# EAGLE design luci2_device_revA (EAGLE 6.3)
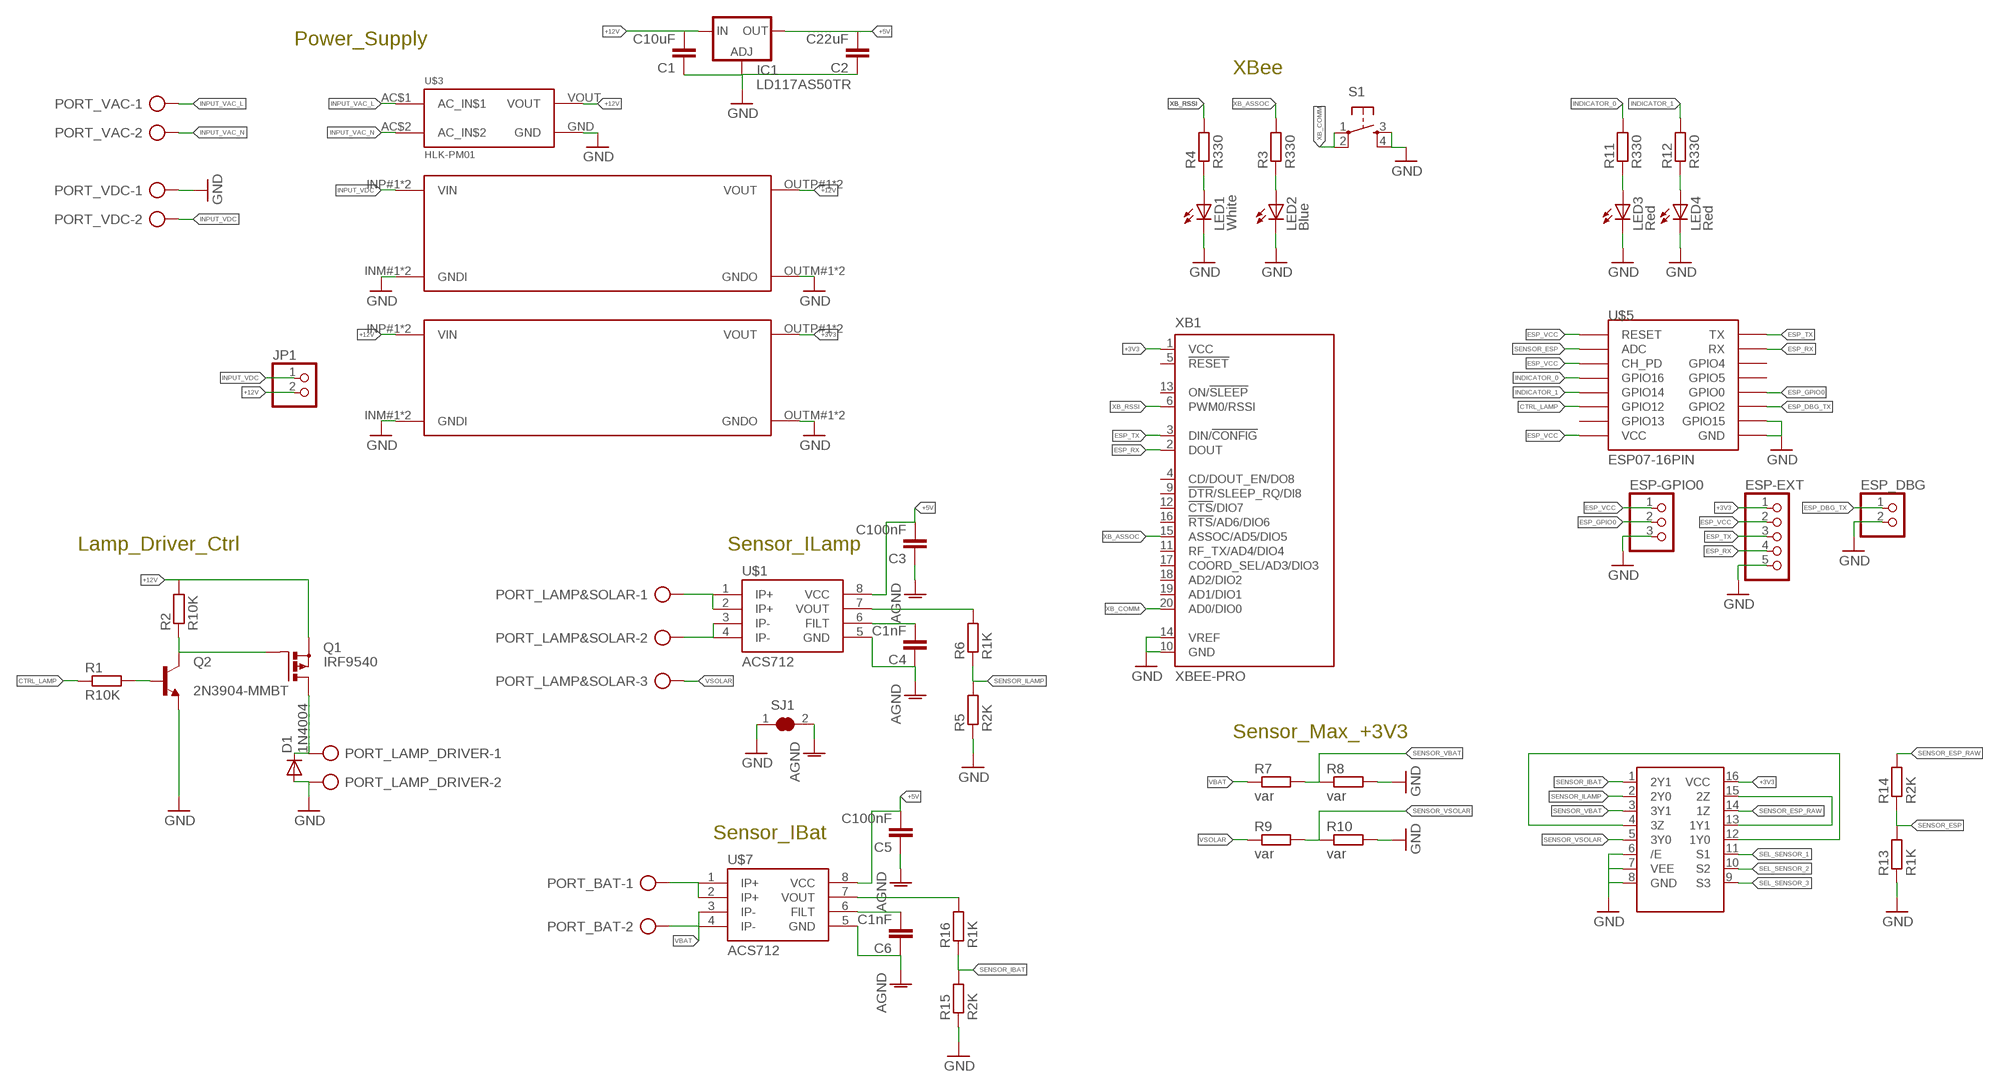
[diagram p0: schematic, sheet 1]

## Parts
C1  C10uF  C-EUC0805  [C0805]
C2  C22uF  C-EUC0805  [C0805]
C3  C100nF  C-EUC0805  [C0805]
C4  C1nF  C-EUC0805  [C0805]
C5  C100nF  C-EUC0805  [C0805]
C6  C1nF  C-EUC0805  [C0805]
D1  1N4004  [DO41-10]
ESP-EXT  HEADER-1X5ROUND  [1X05_ROUND]
ESP-GPIO0  HEADER-1X3ROUND  [1X03_ROUND]
ESP_DBG  HEADER-1X2ROUND  [1X02_ROUND]
IC1  LD117AS50TR  [SOT223]
JP1  HEADER-1X2ROUND  [1X02_ROUND]
LED1  White  LEDCHIPLED_0805  [CHIPLED_0805]
LED2  Blue  LEDCHIPLED_0805  [CHIPLED_0805]
LED3  Red  LEDCHIPLED_0805  [CHIPLED_0805]
LED4  Red  LEDCHIPLED_0805  [CHIPLED_0805]
PORT_BAT  AK300/2  [AK300/2]
PORT_LAMP&SOLAR  AK300/3  [AK300/3]
PORT_LAMP_DRIVER  AK300/2  [AK300/2]
PORT_VAC  AK300/2  [AK300/2]
PORT_VDC  AK300/2  [AK300/2]
Q1  IRF9540  PMOSFET_PTO220BV  [TO220BV]
Q2  2N3904-MMBT  [SOT23]
R1  R10K  R-EU_M0805  [M0805]
R2  R10K  R-EU_M0805  [M0805]
R3  R330  R-EU_M0805  [M0805]
R4  R330  R-EU_M0805  [M0805]
R5  R2K  R-EU_M0805  [M0805]
R6  R1K  R-EU_M0805  [M0805]
R7  var  R-EU_M0805  [M0805]
R8  var  R-EU_M0805  [M0805]
R9  var  R-EU_M0805  [M0805]
R10  var  R-EU_M0805  [M0805]
R11  R330  R-EU_M0805  [M0805]
R12  R330  R-EU_M0805  [M0805]
R13  R1K  R-EU_M0805  [M0805]
R14  R2K  R-EU_M0805  [M0805]
R15  R2K  R-EU_M0805  [M0805]
R16  R1K  R-EU_M0805  [M0805]
S1  TAC_SWITCHPTH  [TACTILE-PTH]
SJ1  SOLDERJUMPER_CLOSED  [SOLDERJUMPER_CLOSEDWIRE]
U$1  ACS712  [SO08]
U$2  DCDCMODULE_SMALL  [DCDCMODULE-SMALL]
U$3  HLK-PM01  [HLK-PM01]
U$4  DCDCMODULE_SMALL  [DCDCMODULE-SMALL]
U$5  ESP07-16PIN  [ESP07-16PIN]
U$6  74HC4053D  [SO16]
U$7  ACS712  [SO08]
XB1  XBEE-PRO  [XBEE-PRO]

## Nets
+3V3: ESP-EXT.1 U$2.OUTP#1(VOUT) U$2.OUTP#2(VOUT) U$6.16(VCC) XB1.1(VCC)
+5V: C2.2 C3.2 C5.2 IC1.4(OUT) U$1.8(VCC) U$7.8(VCC)
+12V: C1.2 IC1.3(IN) JP1.2 Q1.S R2.2 U$2.INP#1(VIN) U$2.INP#2(VIN) U$3.VOUT U$4.OUTP#1(VOUT) U$4.OUTP#2(VOUT)
AGND: C3.1 C4.1 C5.1 C6.1 SJ1.2 U$1.5(GND) U$7.5(GND)
CTRL_LAMP: R1.1 U$5.GPIO12
ESP_DBG_TX: ESP_DBG.1 U$5.GPIO2
ESP_GPIO0: ESP-GPIO0.2 U$5.GPIO0
ESP_RX: ESP-EXT.4 U$5.RX XB1.2(DOUT)
ESP_TX: ESP-EXT.3 U$5.TX XB1.3(DIN/!CONFIG)
ESP_VCC: ESP-EXT.2 ESP-GPIO0.1 U$5.CH_PD U$5.REST(RESET) U$5.VCC
GND: C1.1 C2.1 D1.A ESP-EXT.5 ESP-GPIO0.3 ESP_DBG.2 IC1.1(ADJ) LED1.C LED2.C LED3.C LED4.C PORT_LAMP_DRIVER.2 PORT_VDC.1 Q2.2(E) R5.1 R8.2 R10.2 R13.1 R15.1 S1.3 S1.4 SJ1.1 U$2.INM#1(GNDI) U$2.INM#2(GNDI) U$2.OUTM#1(GNDO) U$2.OUTM#2(GNDO) U$3.GND U$4.INM#1(GNDI) U$4.INM#2(GNDI) U$4.OUTM#1(GNDO) U$4.OUTM#2(GNDO) U$5.GND U$5.GPIO15 U$6.6(/E) U$6.7(VEE) U$6.8(GND) XB1.10(GND) XB1.14(VREF)
INDICATOR_0: R11.2 U$5.GPIO16
INDICATOR_1: R12.2 U$5.GPIO14
INPUT_VAC_L: PORT_VAC.1 U$3.AC$1(AC_IN$1)
INPUT_VAC_N: PORT_VAC.2 U$3.AC$2(AC_IN$2)
INPUT_VDC: JP1.1 PORT_VDC.2 U$4.INP#1(VIN) U$4.INP#2(VIN)
N$1: D1.C PORT_LAMP_DRIVER.1 Q1.D
N$2: Q1.G Q2.3(C) R2.1
N$3: LED1.A R4.1
N$4: Q2.1(B) R1.2
N$5: LED2.A R3.1
N$6: U$6.13(1Y1) U$6.15(2Z)
N$7: R6.2 U$1.7(VOUT)
N$8: PORT_LAMP&SOLAR.1 U$1.1(IP+) U$1.2(IP+)
N$9: U$6.4(3Z) U$6.12(1Y0)
N$10: PORT_LAMP&SOLAR.2 U$1.3(IP-) U$1.4(IP-)
N$11: C4.2 U$1.6(FILT)
N$12: PORT_BAT.1 U$7.1(IP+) U$7.2(IP+)
N$13: C6.2 U$7.6(FILT)
N$14: R16.2 U$7.7(VOUT)
N$15: LED3.A R11.1
N$16: LED4.A R12.1
SEL_SENSOR_1: U$6.11(S1)
SEL_SENSOR_2: U$6.10(S2)
SEL_SENSOR_3: U$6.9(S3)
SENSOR_ESP: R13.2 R14.1 U$5.ADC
SENSOR_ESP_RAW: R14.2 U$6.14(1Z)
SENSOR_IBAT: R15.2 R16.1 U$6.1(2Y1)
SENSOR_ILAMP: R5.2 R6.1 U$6.2(2Y0)
SENSOR_VBAT: R7.2 R8.1 U$6.3(3Y1)
SENSOR_VSOLAR: R9.2 R10.1 U$6.5(3Y0)
VBAT: PORT_BAT.2 R7.1 U$7.3(IP-) U$7.4(IP-)
VSOLAR: PORT_LAMP&SOLAR.3 R9.1
XB_ASSOC: R3.2 XB1.15(ASSOC/AD5/DIO5)
XB_COMM: S1.1 S1.2 XB1.20(AD0/DIO0)
XB_RSSI: R4.2 XB1.6(PWM0/RSSI)
Unconnected: U$5.GPIO4 U$5.GPIO5 U$5.GPIO13 XB1.4(CD/DOUT_EN/DO8) XB1.5(!RESET) XB1.9(!DTR!/SLEEP_RQ/DI8) XB1.11(RF_TX/AD4/DIO4) XB1.12(!CTS!/DIO7) XB1.13(ON/!SLEEP) XB1.16(!RTS!/AD6/DIO6) XB1.17(COORD_SEL/AD3/DIO3) XB1.18(AD2/DIO2) XB1.19(AD1/DIO1)

## Notes on the sheet
- Power_Supply
- XBee
- Lamp_Driver_Ctrl | Sensor_ILamp
- Sensor_Max_+3V3
- Sensor_IBat

## Library data of the parts
C1-C6 = resistor:C-EU: CAPACITOR, European symbol
D1 = diode:1N4004: DIODE general purpose rectifier, 1 A
ESP-EXT = microbuilder:HEADER-1X5: PIN HEADER
ESP-GPIO0 = microbuilder:HEADER-1X3: PIN HEADER
ESP_DBG JP1 = microbuilder:HEADER-1X2: PIN HEADER
IC1 = v-reg:LD117A?*: Low drop fixed and adjustable positive voltage regulators 1 A Source: http://www.st.com/stonline/products/literature/ds/7194/ld1117axx.pdf
LED1-LED4 = adafruit:LED: LED OSRAM: - CHIPLED LG R971, LG N971, LY N971, LG Q971, LY Q971, LO R971, LY R971 LH N974, LH R974 LS Q976, LO Q976, LY Q976 LO Q996 - Hyper CHIPLED LW Q18S LB Q993, LB Q99A, LB R99A - SideLED LS A670, LO A670, LY A670, LG A670, LP A670 LB A673, LV A673, LT A673, LW A673 LH A674 LY A675 LS A676, LA A676, LO A676, LY A676, LW A676 LS A679, LY A679, LG A679 - Hyper Micro SIDELED® LS Y876, LA Y876, LO Y876, LY Y876 LT Y87S - SmartLED LW L88C, LW L88S LB L89C, LB L89S, LG L890 LS L89K, LO L89K, LY L89K LS L896, LA L896, LO L896, LY L896 - TOPLED LS T670, LO T670, LY T670, LG T670, LP T670 LSG T670, LSP T670, LSY T670, LOP T670, LYG T670 LG T671, LOG T671, LSG T671 LB T673, LV T673, LT T673, LW T673 LH T674 LS T676, LA T676, LO T676, LY T676, LB T676, LH T676, LSB T676, LW T676 LB T67C, LV T67C, LT T67C, LS T67K, LO T67K, LY T67K, LW E67C LS E67B, LA E67B, LO E67B, LY E67B, LB E67C, LV E67C, LT E67C LW T67C LS T679, LY T679, LG T679 LS T770, LO T770, LY T770, LG T770, LP T770 LB T773, LV T773, LT T773, LW T773 LH T774 LS E675, LA E675, LY E675, LS T675 LS T776, LA T776, LO T776, LY T776, LB T776 LHGB T686 LT T68C, LB T68C - Hyper Mini TOPLED® LB M676 - Mini TOPLED Santana® LG M470 LS M47K, LO M47K, LY M47K Source: http://www.osram.convergy.de/
PORT_BAT PORT_LAMP_DRIVER PORT_VAC PORT_VDC = con-ptr500:AK300/2: CONNECTOR; OC_FARNELL: unknown; OC_NEWARK: unknown
PORT_LAMP&SOLAR = con-ptr500:AK300/3: CONNECTOR; OC_FARNELL: unknown; OC_NEWARK: unknown
Q1 = transistor-power:PMOSFET_P: Power MOSFET P-Channel
Q2 = m-pad-2.1:2N3904: NPN TRANSISTOR
R1-R16 = resistor:R-EU_: RESISTOR, European symbol
S1 = SparkFun-Electromechanical:TAC_SWITCH: Momentary Switch Button commonly used for reset or general input. Spark Fun Electronics SKU : COM-00097 SMT- SWCH-08247
SJ1 = microbuilder:SOLDERJUMPER_CLOSED: Solder Jumper - Closed These solder jumpers are closed by default CLOSEDWIRE - 10 mil trace between pads that can be cut and resoldered later CLOSEDPERM - 63 mil trace between pads for a permanent connection (used to 'bridge' two signals, a shameless hack for Eagle). Can double as a test point as well (no cream layer)
U$1 U$7 = SparkFun-AnalogIC:ACS712: Hall-effect-based isolated linear current sensor
U$2 U$4 = bontor:DCDCMODULE_SMALL
U$3 = bontor:HLK-PM01
U$5 = esp8266modules:ESP07-16PIN: ESP8266 Wifi module 07 - 16 pins; DIMENSIONS: 22.0 x 16.0 mm; PINS: 16; PITCH: 0.078" / 2 mm
U$6 = tigorcustom:74HC4053D
XB1 = microbuilder:XBEE: XBee (TM) /XBee-PRO(TM) OEM RF Modules Source: MaxStream, Inc. xbee_productmanual.pdf

## Board
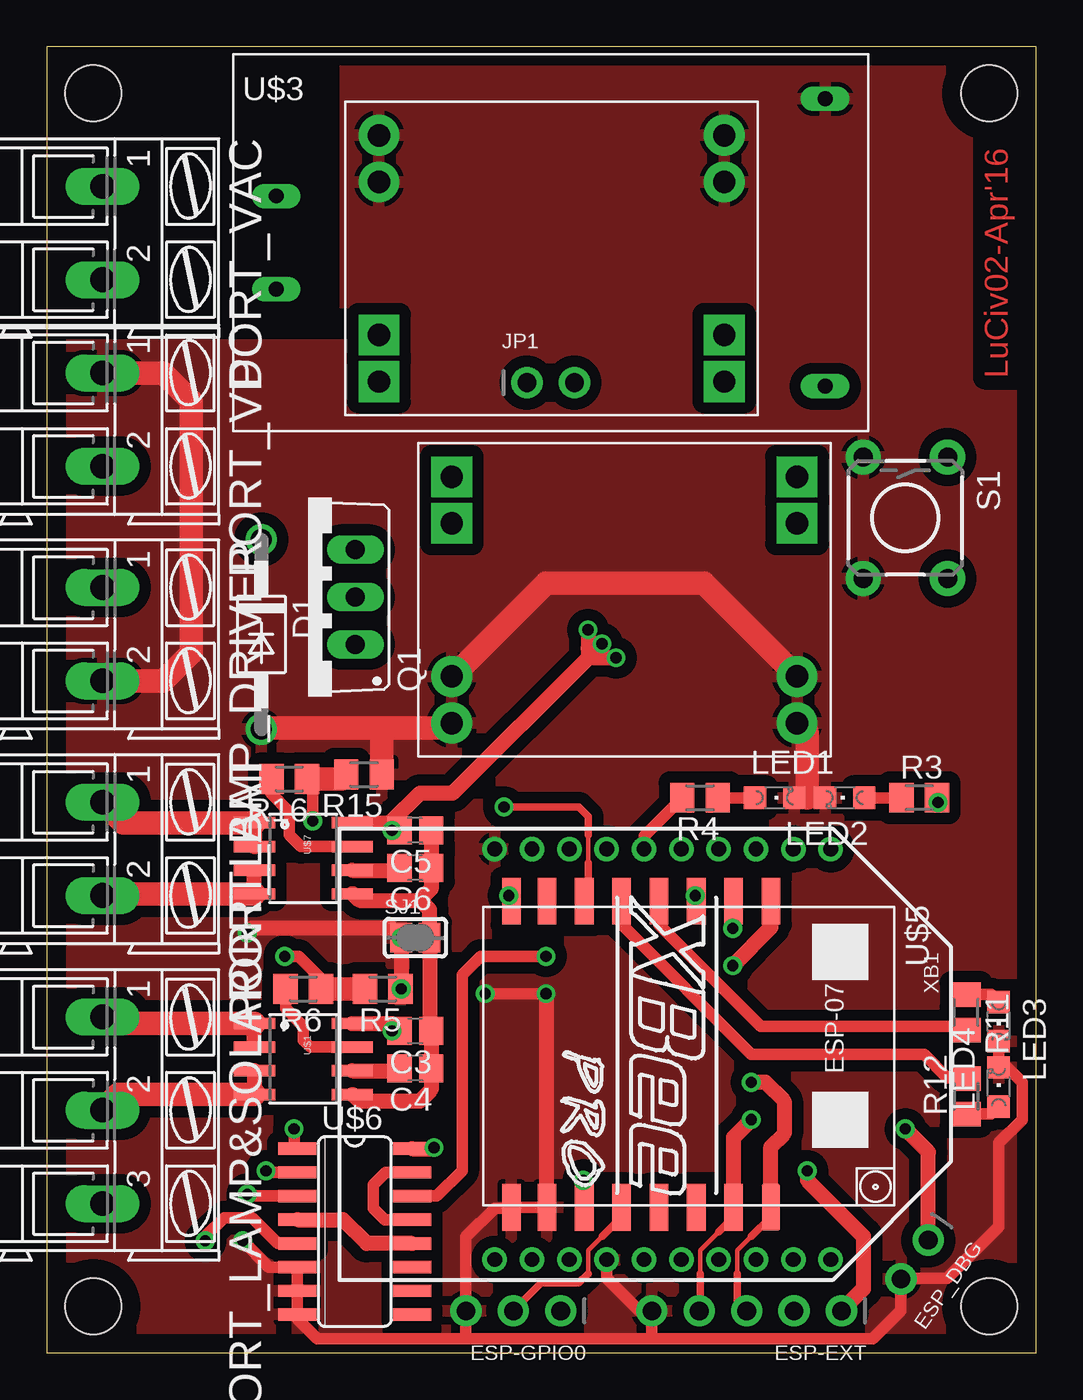
[diagram p1: board, top side]
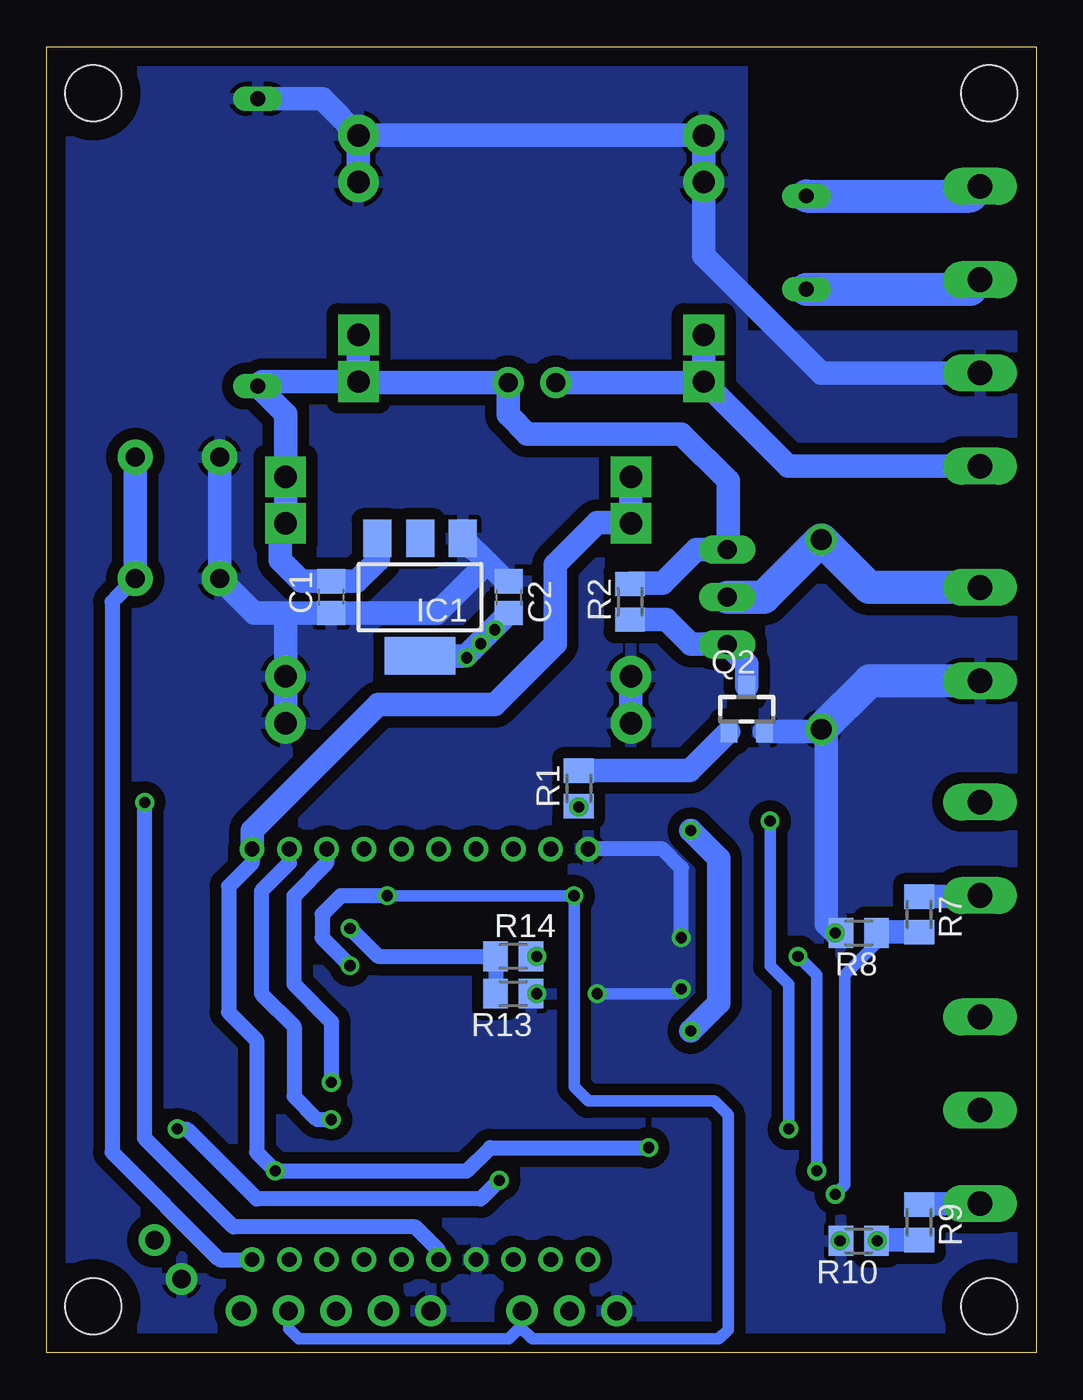
[diagram p2: board, bottom side, seen from below]

Size 53 x 70 mm. Coordinates in mm from the lower left corner, seen from the top.
Outline: 0,0 53,0 53,70 0,70 0,0
Copper layers (1*16): Top 0.035mm / dielectric 1.5mm / Bottom 0.035mm
Design rules "default": minimum track width 10mil, minimum drill 24mil, track to track 8mil, track to pad 8mil, pad to pad 8mil, via to via 8mil, smd to smd 8mil, copper to edge 40mil, drill to drill 8mil, minimum pad ring 10mil, minimum via ring 8mil, stop-mask expansion 4mil, vias tented up to drill 0mil, thermal gap 10mil
Holes 3 mm at 50.5,2.5 2.5,67.5 2.5,2.5 50.5,67.5

### Footprints (pad centres in the part's own frame; a part is rotated, then mirrored left to right if it is on the bottom)
C0805 = smd 1.3 x 1.5: 1 -0.85,0; 2 0.85,0
DO41-10 = drill 1.118: A 5.08,0; C -5.08,0
1X05_ROUND = drill 1 pad 1.676: 1 -5.08,0; 2 -2.54,0; 3 0,0; 4 2.54,0; 5 5.08,0
1X03_ROUND = drill 1 pad 1.676: 1 -2.54,0; 2 0,0; 3 2.54,0
1X02_ROUND = drill 1 pad 1.676: 1 -1.27,0; 2 1.27,0
SOT223 = smd 1.5 x 2: 1 -2.3,-3.15; 2 0,-3.15; 3 2.3,-3.15 | smd 3.8 x 2: 4 0,3.15
CHIPLED_0805 = smd 1.2 x 1.2: A 0,-1.05; C 0,1.05
AK300/2 = drill 1.321 long: 1 -2.515,0; 2 2.489,0
AK300/3 = drill 1.321 long: 1 -5.004,0; 2 0,0; 3 5.004,0
TO220BV = drill 1.016 long: D 0,-2.54; G -2.54,-2.54; S 2.54,-2.54
SOT23 = smd 0.9 x 1.2: 1 -0.95,-1.2; 2 0.95,-1.2; 3 0,1.2
M0805 = smd 1.3 x 1.6: 1 -0.95,0; 2 0.95,0
TACTILE-PTH = drill 1.016 pad 1.88: 1 -3.251,2.261; 2 3.251,2.261; 3 -3.251,-2.261; 4 3.251,-2.261
SOLDERJUMPER_CLOSEDWIRE = smd 1.168 x 1.6: 1 -0.762,0; 2 0.762,0 | smd 0.635 x 0.203: WIRE 0,0
SO08 = smd 0.61 x 2.21: 1 -1.905,-2.616; 2 -0.635,-2.616; 3 0.635,-2.616; 4 1.905,-2.616; 5 1.905,2.616; 6 0.635,2.616; 7 -0.635,2.616; 8 -1.905,2.616
DCDCMODULE-SMALL = drill 1.2 pad 2.184: INM#1 1.8,15; INM#2 1.8,12.5; OUTM#1 20.3,15; OUTM#2 20.3,12.5 | drill 1.2 pad 2.184 square: INP#1 1.8,4.3; INP#2 1.8,1.8; OUTP#1 20.3,4.3; OUTP#2 20.3,1.8
HLK-PM01 = drill 0.8 long: AC$1 -14.7,2.5; AC$2 -14.7,-2.5; GND 14.7,7.7; VOUT 14.7,-7.7
ESP07-16PIN = smd 2.5 x 1: ADC -8.2,3.8; CH_PD -8.2,1.8; GND 8.2,-8.105; GPIO0 8.2,-2.2; GPIO2 8.2,-4.2; GPIO4 8.2,1.8; GPIO5 8.2,-0.2; GPIO12 -8.2,-4.2; GPIO13 -8.2,-6.2; GPIO14 -8.2,-2.2; GPIO15 8.2,-6.2; GPIO16 -8.2,-0.2; REST -8.2,5.8; RX 8.2,3.8; TX 8.2,5.8; VCC -8.2,-8.105
SO16 = smd 0.66 x 2.032: 1 -4.445,-3.073; 2 -3.175,-3.073; 3 -1.905,-3.073; 4 -0.635,-3.073; 5 0.635,-3.073; 6 1.905,-3.073; 7 3.175,-3.073; 8 4.445,-3.073; 9 4.445,3.073; 10 3.175,3.073; 11 1.905,3.073; 12 0.635,3.073; 13 -0.635,3.073; 14 -1.905,3.073; 15 -3.175,3.073; 16 -4.445,3.073
XBEE-PRO = drill 0.8 pad 1.27: 1 -11,9; 2 -11,7; 3 -11,5; 4 -11,3; 5 -11,1; 6 -11,-1; 7 -11,-3; 8 -11,-5; 9 -11,-7; 10 -11,-9; 11 11,-9; 12 11,-7; 13 11,-5; 14 11,-3; 15 11,-1; 16 11,1; 17 11,3; 18 11,5; 19 11,7; 20 11,9

### Placement (x,y rotation side)
C1  37.75,40.5 90 bottom
C2  28.25,40.5 270 bottom
C3  19.75,17.25 180 top
C4  19.75,15.25 180 top
C5  19.75,28 180 top
C6  19.75,26 180 top
D1  11.5,38.5 270 top
ESP-EXT  37.5,2.25 180 top
ESP-GPIO0  25,2.25 180 top
ESP_DBG  46.5,5 235 top
IC1  33,40.5 180 bottom
JP1  27,52 0 top
LED1  39,29.75 270 top
LED2  42.75,29.75 90 top
LED3  51,17.75 180 top
LED4  51,14.25 0 top
PORT_BAT  3,27 270 top
PORT_LAMP&SOLAR  3,13 270 top
PORT_LAMP_DRIVER  3,38.5 270 top
PORT_VAC  3,60 270 top
PORT_VDC  3,50 270 top
Q1  14,40.5 90 top
Q2  15.5,34.5 0 bottom
R1  24.5,30.25 90 bottom
R2  21.75,40.25 90 bottom
R3  46.75,29.75 0 top
R4  35,29.75 180 top
R5  18,19.5 180 top
R6  13.75,19.5 180 top
R7  6.25,23.5 270 bottom
R8  9.5,22.5 180 bottom
R9  6.25,7 270 bottom
R10  9.5,6 180 bottom
R11  49.25,18.25 270 top
R12  49.25,13.75 90 top
R13  28,19.25 180 bottom
R14  28,21.25 0 bottom
R15  17,31 180 top
R16  13,30.75 180 top
S1  46,44.75 270 top
SJ1  19.75,22.25 0 top
U$1  13.75,15.75 270 top
U$2  42,48.75 180 top
U$3  27,59.5 0 top
U$4  16,50.25 0 top
U$5  33,16 270 top
U$6  16.5,6.5 270 top
U$7  13.75,26.5 270 top
XB1  33,16 270 top

### Tracks (layer width: path | path; a pad name or v marks a point on that pad's centre or on a via)
+3V3  (via drill 0.6)
  Top 0.813: U$6.16 20.7,10.95 v20.75,11 | ESP-EXT.1 43.75,3.42 43.75,6.25 40.75,9.25 v40.75,9.75
  Bottom 0.813: XB1.1 42,26.25 43.25,25 43.25,18.25 41.75,16.75 41.75,10.75 v40.75,9.75 30.5,9.75 29.25,11 v20.75,11
  Bottom 1.27: U$2.OUTP#2 U$2.OUTP#1 22.55,44.45 22.6,44.5 23.5,44.5 25.75,42.25 25.75,38 29,34.75 35.25,34.75 42,28 XB1.1
+5V  (via drill 0.6)
  Top 0.61: C3.2 v18.5,17.25 | C5.2 v18.5,28
  Top 0.813: U$7.8 18.5,28.41 | 18.5,28.41 C5.2 | U$1.8 18.5,17.66 C3.2 | 18.5,28.41 18.5,28.5 20,30 21.75,30 29,37.25 | v29,38.75 29,37.75 | 29,37.75 29,37.25 | v30.5,37.25 29,37.25 | v29.75,38 29.25,38 29,37.75
  Bottom 0.813: 29.9,38 30.2,37.7 | 30.55,37.35 30.55,37.3 v30.5,37.25
  Bottom 1.27: IC1.4 30.55,37.35 30.2,37.7 C2.2 | v18.5,17.25 17,18.75 17,26.5 v18.5,28
+12V
  Bottom 1.27: U$4.OUTP#1 U$4.OUTP#2 | U$4.OUTP#2 36.25,52 JP1.2 28.27,50.27 27.25,49.25 19,49.25 16.5,46.75 16.5,43.08 Q1.S 18.21,43.04 20,41.25 21.7,41.25 R2.2 | U$4.OUTP#2 41.45,52.05 U$3.VOUT 40.2,50.3 U$2.INP#2 U$2.INP#1 40.2,44.3 40.5,44 40.5,42.5 39.35,41.35 C1.2 36.4,41.35 35.25,42.5 35.25,43.6 IC1.3
AGND
  Top 0.813: C5.1 C6.1 20.6,24.85 20,24.25 | U$7.5 16.41,24.59 16.75,24.25 20,24.25 | 20,24.25 20.51,23.74 SJ1.2 20.51,17.34 C3.1 C4.1 20.6,14.1 20,13.5 16.75,13.5 16.41,13.85 U$1.5
CTRL_LAMP  (via drill 0.6)
  Top 0.254: 29,27.75 29,26.25
  Top 0.406: v24.5,29.25 28.5,29.25 29,28.75 29,27.75 | 29,26.25 29,24.4 U$5.GPIO12
  Bottom 0.61: R1.1 v24.5,29.25
ESP_DBG_TX  (via drill 0.6)
  Top 0.813: U$5.GPIO2 28.8,9.2 v28.75,9.25 | ESP_DBG.1 47.23,10.77 v46,12
  Bottom 0.813: v28.75,9.25 29.75,8.25 41.75,8.25 45.5,12 v46,12
ESP_GPIO0
  Top 0.254: 29,4.25 29,5.5 29.75,6.25
  Top 0.406: ESP-GPIO0.2 26.5,3.75 28.5,3.75 29,4.25 | 29.75,6.25 30.75,7.25 30.75,7.75 U$5.GPIO0
ESP_RX  (via drill 0.6)
  Top 0.254: 35,4.25 35,5.5 36,6.5
  Top 0.406: ESP-EXT.4 34.96,2.46 35,2.5 35,4.25 | 36,6.5 36.75,7.25 36.75,7.75 U$5.RX
  Top 0.813: U$5.RX 36.8,11.55 v37.75,12.5
  Bottom 0.813: v37.75,12.5 38.5,12.5 39.75,13.75 39.75,17.5 41.5,19.25 41.5,24.75 40,26.25 XB1.2
ESP_TX  (via drill 0.6)
  Top 0.254: 37,4.25 37,5.5 37.75,6.25
  Top 0.406: ESP-EXT.3 37,2.75 37,4.25 | 37.75,6.25 38.75,7.25 38.75,7.75 U$5.TX
  Top 0.813: U$5.TX 38.8,11.05 39.5,11.75 39.5,13.5 38.5,14.5 v37.75,14.5
  Bottom 0.813: XB1.3 38,26.25 39.75,24.5 39.75,19.75 37.75,17.75 v37.75,14.5
ESP_VCC  (via drill 0.6)
  Top 0.406: U$5.VCC 24.89,24.36 | U$5.CH_PD 34.8,24.45 v34.75,24.5 | U$5.REST 38.8,24.45
  Top 0.61: v24.75,24.5 24.75,24.34 U$5.VCC
  Top 0.813: 38.8,24.45 38.8,22.8 v36.75,20.75
  Bottom 0.61: ESP-GPIO0.1 27.54,1.46 27.62,1.38 | 27.62,1.38 28.25,0.75 39.5,0.75 40.04,1.29 ESP-EXT.2 | 27.62,1.38 27,0.75 17,0.75 16.5,1.25 16.5,12.75 17.25,13.5 24,13.5 24.75,14.25 v24.75,24.5 v34.75,24.5
  Bottom 0.813: v34.75,24.5 37.25,24.5 38.25,23.5 38.25,22.25 v36.75,20.75
GND  (via drill 0.6)
  Top 0.61: v10.5,6 11.9,4.59 U$6.6 U$6.7 U$6.8 13.43,1.82 14.5,0.75 22.25,0.75 | v19,22.25 SJ1.1 | LED1.C 40.75,29.75 LED2.C | LED3.C LED4.C 51.45,15.3 52.25,14.5 52.25,12.5 51,11.25 51,6.75 48.25,4 45.81,4 ESP_DBG.2 45.75,3.94 45.75,2.25 44.25,0.75 32.25,0.75 | U$5.GPIO15 U$5.GND 24.84,7.75 24,7.75 22.46,6.21 ESP-GPIO0.3 22.46,0.96 22.25,0.75 | 22.25,0.75 32.25,0.75 | 32.25,0.75 32.42,0.92 ESP-EXT.5 31.75,2.25 30,4 XB1.14 | R5.1 v19,19.5 | v23.5,19.25 v26.75,19.25
  Top 0.813: R5.1 18.99,19.54 SJ1.1 18.99,22.26 18.5,22.75 11,22.75 v10.75,22.5 | U$5.GPIO15 26.8,19.2 v26.75,19.25
  Top 1.27: U$2.OUTM#1 21.5,33.75 21.25,33.5 17.75,33.5 | 17.75,33.5 11.58,33.5 D1.A | R15.1 17.95,33.3 17.75,33.5 | U$2.OUTM#2 21.75,36.25 26.75,41.25 35.2,41.25 U$2.INM#2 | U$2.INM#1 40.25,33.75 40.75,33.25 40.75,29.75 | PORT_VDC.1 6.24,52.52 7.75,51 7.75,37.51 6.25,36.01 PORT_LAMP_DRIVER.2
  Bottom 0.61: v10.75,22.5 R8.2 | R10.2 v10.5,6 | R13.1 v26.75,19.25 | v23.5,19.25 19.25,19.25 v19,19.5
  Bottom 0.813: v19,22.25 19,26 20,27 XB1.10
  Bottom 1.27: PORT_VDC.1 11.52,52.52 17.8,58.8 U$4.INM#2 U$4.INM#1 U$4.OUTM#1 | U$4.OUTM#1 U$4.OUTM#2 | U$3.GND 38.25,67.2 U$4.OUTM#1 | U$2.INM#1 U$2.INM#2 40.2,39.6 40.25,39.65 | U$2.OUTM#2 U$2.OUTM#1 | Q2.2 11.62,33.3 D1.A 11.25,33.17 11.25,23 v10.75,22.5 | C2.1 28.4,41.35 29.4,42.35 | 29.4,42.35 IC1.1 | S1.3 S1.4 41.89,39.65 40.25,39.65 | 40.25,39.65 C1.1 32.1,39.65 29.4,42.35
  Bottom 1.778: PORT_LAMP_DRIVER.2 8.91,36.01 D1.A
  pour Top (isolate 0.61): 16,70 53,70 53,0 0,0 0,54 16,54
  pour Bottom (isolate 0.61): 15.75,70 53,70 53,0 0,0 0,54.5 15.75,54.5
INDICATOR_0
  Top 0.61: U$5.GPIO16 32.8,22.95 38.25,17.5 49.05,17.5 R11.2
INDICATOR_1
  Top 0.61: U$5.GPIO14 30.8,22.95 37.75,16 47,16 48.25,14.75 49.2,14.75 R12.2
INPUT_VAC_L
  Bottom 1.778: U$3.AC$1 3.52,62 PORT_VAC.1
INPUT_VAC_N
  Bottom 1.778: U$3.AC$2 3.51,57 PORT_VAC.2
INPUT_VDC
  Bottom 1.27: U$4.INP#1 U$4.INP#2 | JP1.1 17.85,52 U$4.INP#2 | PORT_VDC.2 13.26,47.51 U$4.INP#2
N$1
  Bottom 1.778: PORT_LAMP_DRIVER.1 8.94,41.02 D1.C 14.58,40.5 Q1.D
N$2
  Bottom 1.27: Q2.3 15.5,36.92 Q1.G 16.58,38 18.5,38 19.8,39.3 R2.1
N$3
  Top 0.61: LED1.A R4.1
N$4
  Bottom 1.27: R1.2 18.55,31.2 Q2.1
N$5
  Top 0.61: LED2.A R3.1
N$6
  Top 0.61: U$6.13 18.11,7.13 17.5,7.75 17.5,9 18.18,9.68 U$6.15
N$7
  Top 0.61: R6.2 12.8,18.45 13.75,17.5 13.75,16.75 14.12,16.39 U$1.7
N$8
  Top 0.813: U$1.2 U$1.1
  Top 1.27: U$1.1 3.35,17.66 PORT_LAMP&SOLAR.1
N$9
  Top 0.813: U$6.4 15.87,7.13 17.14,5.87 U$6.12
N$10
  Top 0.813: U$1.3 U$1.4
  Top 1.27: U$1.4 3.85,13.85 PORT_LAMP&SOLAR.2
N$11
  Top 0.813: U$1.6 18.77,15.12 C4.2
N$12
  Top 0.813: U$7.1 U$7.2
  Top 1.27: U$7.1 4.11,28.41 PORT_BAT.1
N$13
  Top 0.813: U$7.6 18.77,25.86 C6.2
N$14
  Top 0.61: U$7.7 13.62,27.14 13,27.75 13,29 12,30 12,30.7 R16.2
N$15
  Top 0.61: R11.1 50.6,19.2 LED3.A
N$16
  Top 0.61: R12.1 50.6,12.8 LED4.A
SENSOR_ESP  (via drill 0.6)
  Top 0.813: U$5.ADC 36.8,22.8 v36.75,22.75
  Bottom 0.813: v36.75,22.75 35.25,21.25 R14.1 R13.2
SENSOR_ESP_RAW  (via drill 0.6)
  Top 0.61: U$6.14 20.91,8.4 22.25,9.75 22.25,20.25 23.25,21.25 v26.75,21.25
  Bottom 0.61: R14.2 v26.75,21.25
SENSOR_IBAT  (via drill 0.6)
  Top 0.61: v13.25,12 13.25,11.12 U$6.1 | v14.25,28.5 14.25,30.45 R16.1
  Top 1.27: R16.1 15.8,30.75 R15.2
  Bottom 0.61: v14.25,28.5 14.25,20.75 13.25,19.75 v13.25,12
SENSOR_ILAMP  (via drill 0.6)
  Top 0.61: R6.1 14.7,20.05 13.5,21.25 v12.75,21.25 | U$6.2 11.82,9.68 v11.75,9.75
  Top 1.27: R6.1 R5.2
  Bottom 0.61: v11.75,9.75 11.75,20.25 v12.75,21.25
SENSOR_VBAT  (via drill 0.6)
  Top 0.61: U$6.3 10.85,8.4 v10.75,8.5
  Bottom 0.61: R8.1 8.55,21.95 10.25,20.25 10.25,9 v10.75,8.5
  Bottom 1.27: R7.2 8.5,22.55 R8.1
SENSOR_VSOLAR  (via drill 0.6)
  Top 0.61: U$6.5 12.38,5.87 11,7.25 9.5,7.25 8.5,6.25 v8.5,6
  Bottom 0.61: 8.5,6.05 8.7,6.05 v8.5,6
  Bottom 1.27: R9.2 8.5,6.05 R10.1
VBAT
  Top 0.813: U$7.4 U$7.3
  Top 1.27: U$7.4 3.08,24.59 PORT_BAT.2
  Bottom 1.27: R7.1 3.06,24.45 PORT_BAT.2
VSOLAR
  Bottom 1.27: PORT_LAMP&SOLAR.3 6.2,8 R9.1
XB_ASSOC  (via drill 0.6)
  Top 0.813: v47.75,29.5 47.75,29.7 R3.2
  Bottom 0.813: XB1.15 32,5.5 33.25,6.75 43,6.75 47.75,11.5 v47.75,29.5
XB_COMM
  Bottom 0.813: XB1.20 43.75,5 49.5,10.75 49.5,40.25 49.25,40.5 49.25,40.51 S1.2
  Bottom 1.27: S1.1 S1.2
XB_RSSI
  Top 0.61: XB1.6 32,27.7 R4.2

### Text on the board
Top: LuCiv02-Apr'16